# EAGLE design pidshield-mk-2 (EAGLE 6.5.0)
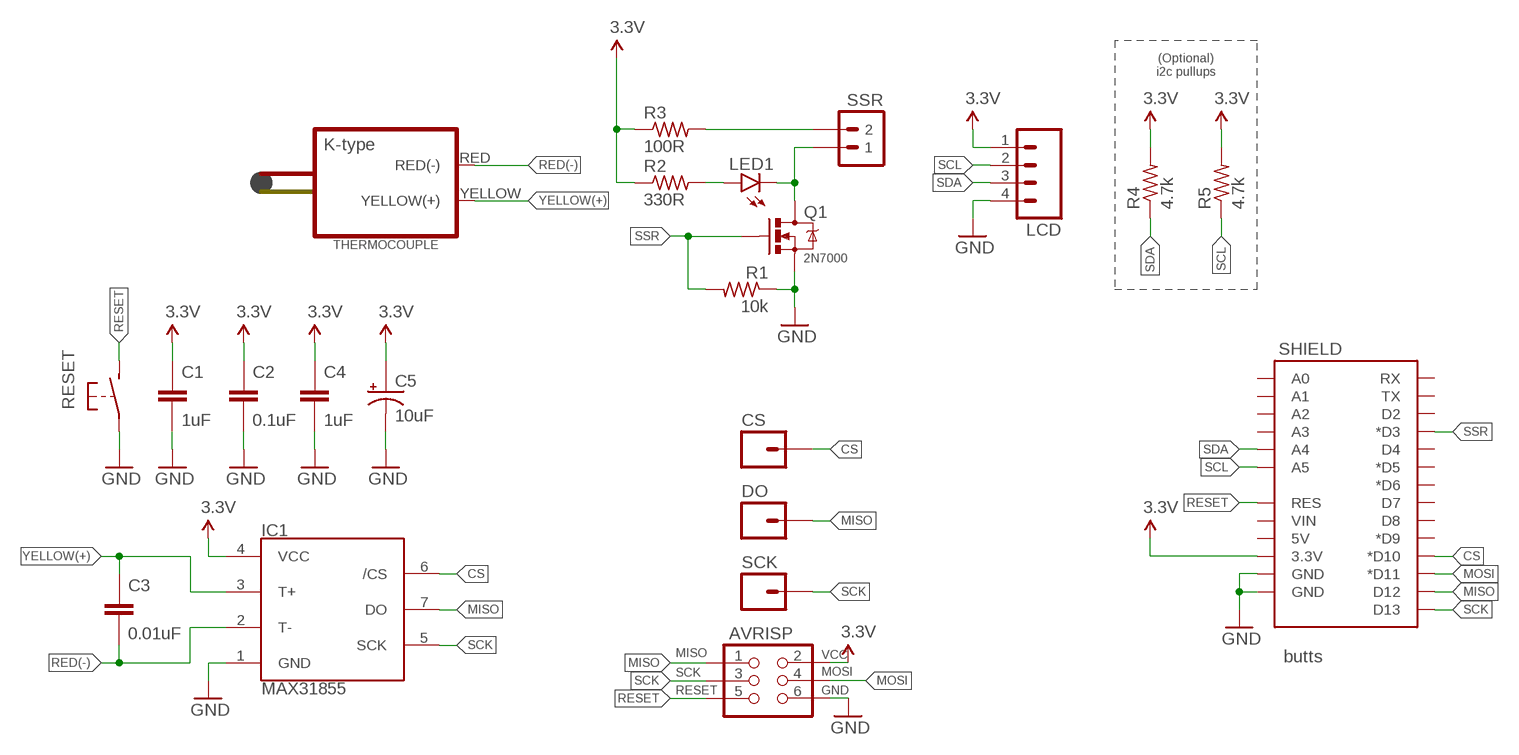
[diagram p0: schematic, sheet 1]

## Parts
AVRISP  AVR_SPI_PRG_6PTH  [2X3]
C1  1uF  CAPACITOR-CERAMIC025-024X044  [C025-024X044]
C2  0.1uF  CAPACITOR-CERAMIC025-024X044  [C025-024X044]
C3  0.01uF  CAPACITOR-CERAMIC025-024X044  [C025-024X044]
C4  1uF  CAPACITOR-CERAMIC025-024X044  [C025-024X044]
C5  10uF  CAPACITOR-POLARIZEDE2-5  [E2-5]
CS  M01PTH  [1X01]
DO  M01PTH  [1X01]
IC1  MAX31855  MAX31855SOIC  [SOIC127P600X175-8N]
LCD  M04JST_XH_RA  [JST-4-XH-RA-PTH]
LED1  LED3MM  [LED3MM]
Q1  2N7000  MOSFET-NCHANNEL2N7000-AMMO  [TO-92-AMMO]
R1  10k  RESISTORPTH-AXIAL-6.35MM  [RESISTOR-AXIAL-PTH-6.35MM]
R2  330R  RESISTORPTH-AXIAL-6.35MM  [RESISTOR-AXIAL-PTH-6.35MM]
R3  100R  RESISTORPTH-AXIAL-6.35MM  [RESISTOR-AXIAL-PTH-6.35MM]
R4  4.7k  RESISTORPTH-AXIAL-6.35MM  [RESISTOR-AXIAL-PTH-6.35MM]
R5  4.7k  RESISTORPTH-AXIAL-6.35MM  [RESISTOR-AXIAL-PTH-6.35MM]
RESET  SPST-NO-TACT6MM-PTH-SMALL-PADS  [DTS-6-SMALL-PADS]
SCK  M01PTH  [1X01]
SHIELD  butts  ARDUINO_SHIELD_SMALLER  [ARDUINO_SHIELD_NOOUTLINE_INSIDE_SMALLER]
SSR  M02JST-PTH-RA-SMALLPADS  [JST-2-PH-RA-PTH-SMALLPADS]
THERMOCOUPLE  THERMOCOUPLE-CONNECTORMINI-PCB  [PCC-SMP]

## Nets
3.3V: AVRISP.2(VCC) C1.1 C2.1 C4.1 C5.+ IC1.4(VCC) LCD.1 R2.P$1 R3.P$1 R4.P$2 R5.P$2 SHIELD.3.3V
CS: CS.1 IC1.6(/CS) SHIELD.D10(*D10)
GND: AVRISP.6(GND) C1.2 C2.2 C4.2 C5.- IC1.1(GND) LCD.4 Q1.1(S) R1.P$1 RESET.1 RESET.2 SHIELD.GND@0(GND) SHIELD.GND@1(GND)
MISO: AVRISP.1(MISO) DO.1 IC1.7(DO) SHIELD.D12
MOSI: AVRISP.4(MOSI) SHIELD.D11(*D11)
N$2: LED1.A R2.P$2
N$3: LED1.K(C) Q1.3(D) SSR.1
N$4: R3.P$2 SSR.2
RED(-): C3.2 IC1.2(T-) THERMOCOUPLE.RED(RED(-))
RESET: AVRISP.5(RESET) RESET.3 RESET.4 SHIELD.RES
SCK: AVRISP.3(SCK) IC1.5(SCK) SCK.1 SHIELD.D13
SCL: LCD.2 R5.P$1 SHIELD.A5
SDA: LCD.3 R4.P$1 SHIELD.A4
SSR: Q1.2(G) R1.P$2 SHIELD.D3(*D3)
YELLOW(+): C3.1 IC1.3(T+) THERMOCOUPLE.YELLOW(YELLOW(+))
Unconnected: SHIELD.5V SHIELD.A0 SHIELD.A1 SHIELD.A2 SHIELD.A3 SHIELD.D2 SHIELD.D4 SHIELD.D5(*D5) SHIELD.D6(*D6) SHIELD.D7 SHIELD.D8 SHIELD.D9(*D9) SHIELD.RX SHIELD.TX SHIELD.VIN

## Notes on the sheet
- (Optional)
  i2c pullups

## Library data of the parts
AVRISP = A_butts:AVR_SPI_PRG_6: AVR ISP 6 Pin This is the reduced ISP connector for AVR programming. Common on Arduino. This footprint will take up less PCB space and can be used with a 10-pin to 6-pin adapter such as SKU: BOB-08508 **Special note about "TEST_POINT" package. The stop mask is on the top side, so if you want your programming test points to be on the bottom of your board, make sure to place this package on the bottom side of the board. This also ensure that the orientation to program from the bottom side will be correct.
C1-C4 = A_butts:CAPACITOR-CERAMIC: CAPACITOR, European symbol
C5 = A_butts:CAPACITOR-POLARIZED: POLARIZED CAPACITOR, American symbol
CS DO SCK = A_butts:M01: Header 1 Standard 1-pin 0.1" header. Use with straight break away headers (SKU : PRT-00116), right angle break away headers (PRT-00553), swiss pins (PRT-00743), machine pins (PRT-00117), and female headers (PRT-00115).
IC1 = A_butts:MAX31855
LCD = A_butts:M04: Header 4 Standard 4-pin 0.1" header. Use with straight break away headers (SKU : PRT-00116), right angle break away headers (PRT-00553), swiss pins (PRT-00743), machine pins (PRT-00117), and female headers (PRT-00115). Molex polarized connector foot print use with SKU : PRT-08231 with associated crimp pins and housings. 1MM SMD Version SKU: PRT-10208
LED1 = A_butts:LED: LEDs Standard schematic elements and footprints for 5mm, 3mm, 1206, and 0603 sized LEDs. 5mm - Spark Fun Electronics SKU : COM-00529 (and others)
Q1 = A_butts:MOSFET-NCHANNEL: Common NMOSFET Parts MFG P/N Store ID Prod ID FDD8780 TRANS-09984 SI7820DN TRANS-11055 FDS6630A IC-08089 2N7002PW TRANS-11151 FQP30N06L COM-10213 TRANS-10060 BSS123LT1G TRANS-08345 BSS138 TRANS-00830 BS170 2N7000
R1-R5 = A_butts:RESISTOR: RESISTOR, American symbol
RESET = A_butts:SPST-NO-TACT
SHIELD = A_butts:ARDUINO_SHIELD_SMALLER
SSR = A_butts:M02: Standard 2-pin 0.1" header. Use with - straight break away headers ( PRT-00116) - right angle break away headers (PRT-00553) - swiss pins (PRT-00743) - machine pins (PRT-00117) - female headers (PRT-00115) Molex polarized connector foot print use with: PRT-08233 with associated crimp pins and housings. 2.54_SCREWTERM for use with PRT-10571. 3.5mm Screw Terminal footprints for PRT-08084 5mm Screw Terminal footprints for use with PRT-08433
THERMOCOUPLE = A_butts:THERMOCOUPLE-CONNECTOR

## Board
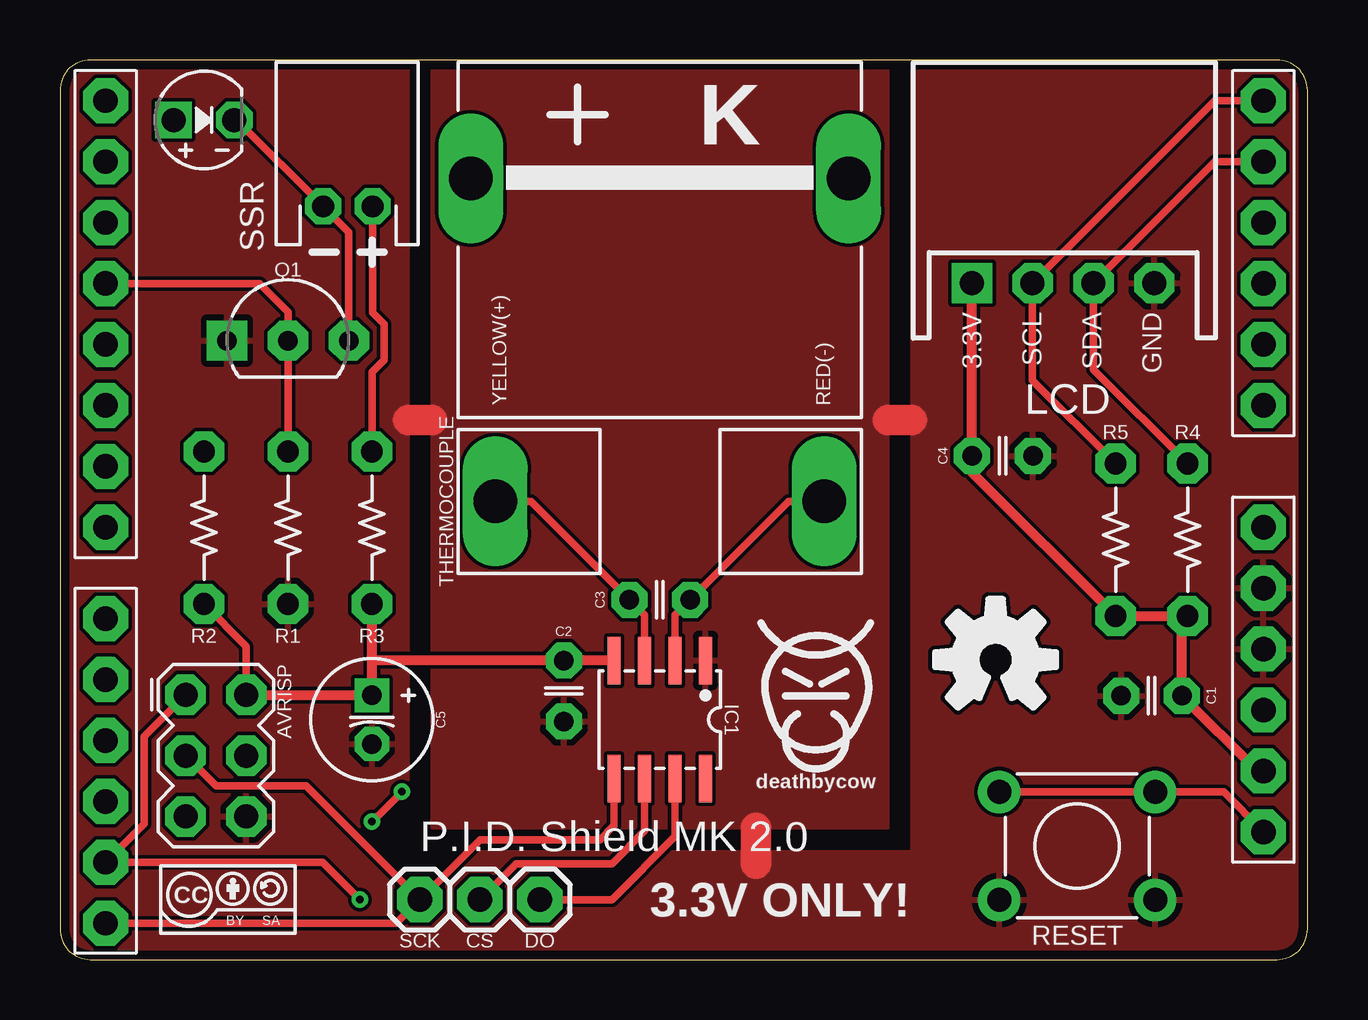
[diagram p1: board, top side]
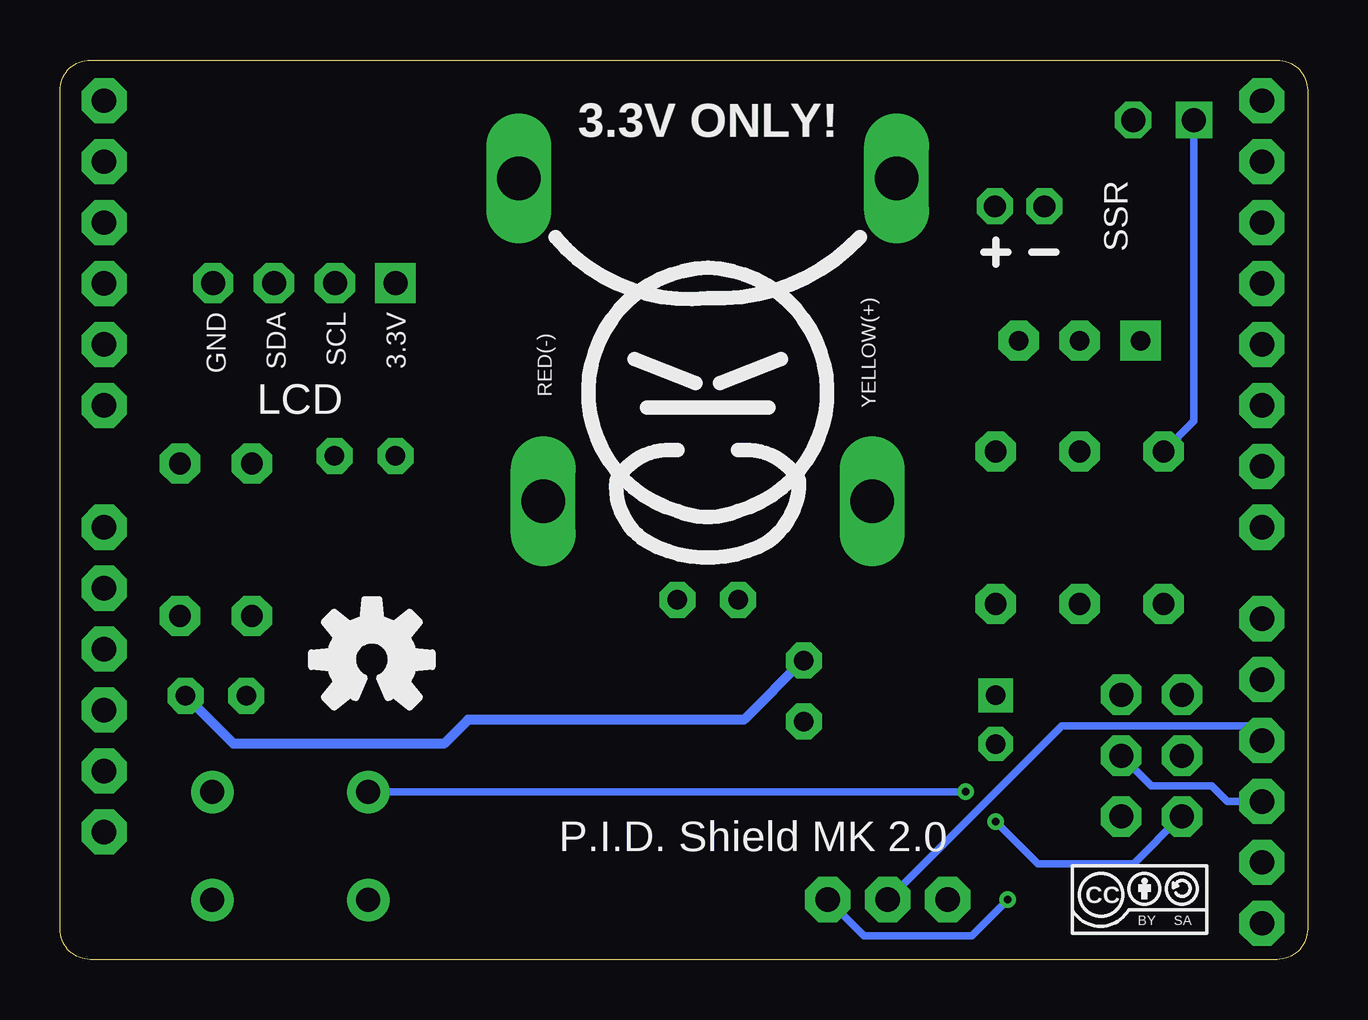
[diagram p2: board, bottom side, seen from below]

Size 52 x 37.5 mm. Coordinates in mm from the lower left corner, seen from the top.
Outline: 0,36.23 0,1.27 arc90 1.27,0 50.73,0 arc90 52,1.27 52,36.23 arc90 50.73,37.5 1.27,37.5 arc90 0,36.23
Copper layers (1*16): Top 0.0356mm / dielectric 1.5011mm / Bottom 0.0356mm
Design rules "LaenPCBOrder2": minimum track width 6mil, minimum drill 13mil, track to track 6mil, track to pad 6mil, pad to pad 6mil, via to via 6mil, smd to smd 6mil, copper to edge 15mil, drill to drill 6mil, minimum pad ring 7mil, minimum via ring 7mil, stop-mask expansion 3mil, vias tented up to drill 20mil, thermal gap 10mil

### Footprints (pad centres in the part's own frame; a part is rotated, then mirrored left to right if it is on the bottom)
2X3 = drill 1 pad 1.676 octagon: 1 -2.54,-1.27; 2 -2.54,1.27; 3 0,-1.27; 4 0,1.27; 5 2.54,-1.27; 6 2.54,1.27
C025-024X044 = drill 0.813 pad 1.5 octagon: 1 -1.27,0; 2 1.27,0
E2-5 = drill 0.813 pad 1.422 square: + -1.016,0 | drill 0.813 pad 1.422 octagon: - 1.016,0
1X01 = drill 1.016 pad 1.88 octagon: 1 0,0
SOIC127P600X175-8N = smd 1.981 x 0.559: 1 -2.464,1.905; 2 -2.464,0.635; 3 -2.464,-0.635; 4 -2.464,-1.905; 5 2.464,-1.905; 6 2.464,-0.635; 7 2.464,0.635; 8 2.464,1.905
JST-4-XH-RA-PTH = drill 1 pad 1.676 square: 1 0.02,0 | drill 1 pad 1.676 octagon: 2 2.54,0; 3 5.08,0; 4 7.62,0
LED3MM = drill 1 pad 1.524 square: A -1.27,0 | drill 1 pad 1.524 octagon: K 1.27,0
TO-92-AMMO = drill 0.813 pad 1.676 square: 1 -2.54,0 | drill 0.813 pad 1.676 octagon: 2 0,0; 3 2.54,0
RESISTOR-AXIAL-PTH-6.35MM = drill 0.9 pad 1.676 octagon: P$1 -3.175,0; P$2 3.175,0
DTS-6-SMALL-PADS = drill 1 pad 1.778: 1 -3.25,2.25; 2 3.25,2.25; 3 -3.25,-2.25; 4 3.25,-2.25
ARDUINO_SHIELD_NOOUTLINE_INSIDE_SMALLER = drill 1.016 pad 1.88 octagon: 3.3V 48.26,-27.94; 5V 48.26,-25.4; A0 48.26,-12.7; A1 48.26,-10.16; A2 48.26,-7.62; A3 48.26,-5.08; A4 48.26,-2.54; A5 48.26,0; D2 0,-5.08; D3 0,-7.62; D4 0,-10.16; D5 0,-12.7; D6 0,-15.24; D7 0,-17.78; D8 0,-21.59; D9 0,-24.13; D10 0,-26.67; D11 0,-29.21; D12 0,-31.75; D13 0,-34.29; GND@0 48.26,-22.86; GND@1 48.26,-20.32; RES 48.26,-30.48; RX 0,0; TX 0,-2.54; VIN 48.26,-17.78
JST-2-PH-RA-PTH-SMALLPADS = drill 0.9 pad 1.5 octagon: 1 -1.03,0; 2 1.03,0
PCC-SMP = drill 1.8 long: P$1 13.462,-7.874; P$2 13.462,7.874; RED 0,-6.858; YELLOW 0,6.858

### Placement (x,y rotation side)
AVRISP  6.5,8.5 270 top
C1  45.5,11 180 top
C2  21,11.19 270 top
C3  25,15 0 top
C4  39.29,21 0 top
C5  13,10 270 top
CS  17.5,2.5 180 top
DO  20,2.5 180 top
IC1  25,10 270 top
LCD  38,28.2 0 top
LED1  6,35 0 top
Q1  9.5,25.8 0 top
R1  9.5,18 90 top
R2  6,18 90 top
R3  13,18 90 top
R4  47,17.5 270 top
R5  44,17.5 270 top
RESET  42.4,4.73 180 top
SCK  15,2.5 180 top
SHIELD  1.9,35.8 0 top
SSR  12,31.4 0 top
THERMOCOUPLE  25,19.1 90 top
U$2  [COW]  25,22.5 0 bottom
U$3  [COW_SMALL]  31.5,11.5 0 top
U$4  [CC-BY-SA-4.0-NO-URL]  7,2.5 0 top
U$5  [CC-BY-SA-4.0-NO-URL]  7,2.5 0 bottom
U$6  [OSHWLOGO_TOP_0.2_A]  39,12.5 0 top
U$7  [OSHWLOGO_BOT_0.2_A]  39,12.5 0 top

### Tracks (layer width: path | path; a pad name or v marks a point on that pad's centre or on a via)
3.3V
  Top 0.305: R2.P$1 7.77,13.05 AVRISP.2
  Top 0.406: SHIELD.3.3V 49.91,7.86 C1.1 46.77,14.32 R4.P$2 R5.P$2 38.02,20.3 C4.1 LCD.1 | 13,12.5 C5.+ 12.98,11.04 AVRISP.2 | 13,12.5 R3.P$1 | 13,12.5 13.04,12.46 C2.1 IC1.4
  Bottom 0.406: C2.1 21.04,12.46 23.5,10 35,10 36,9 44.77,9 C1.1
CS
  Top 0.305: IC1.6 24.36,5.37 23,4 19,4 CS.1
  Bottom 0.305: CS.1 10.25,9.75 2.52,9.75 SHIELD.D10
GND
  Top 1.27: 34.5,22.5 35.5,22.5 | 14.5,22.5 15.5,22.5 | 29,4 29,5.5
  pour Top: 50.73,0 1.27,0 arc-90 0,1.27 0,36.23 arc-90 1.27,37.5 14.5,37.5 14.5,4.5 35.5,4.5 35.5,37.5 50.73,37.5 arc-90 52,36.23 52,1.27 arc-90
  pour Top: 15.5,37.5 34.5,37.5 34.5,5.5 15.5,5.5
MISO  (via drill 0.33)
  Top 0.305: DO.1 23,2.5 25.64,5.13 IC1.7 | v12.5,2.5 10.95,4.05 SHIELD.D12 3.5,5.65 3.5,9.31 AVRISP.1
  Bottom 0.305: v12.5,2.5 14,1 18.5,1 DO.1
MOSI
  Bottom 0.305: SHIELD.D11 3.34,6.59 4,7.25 6.52,7.25 AVRISP.4
N$2
  Bottom 0.305: R2.P$2 4.73,22.45 LED1.A
N$3
  Top 0.305: LED1.K 7.37,35 SSR.1 12.04,30.33 Q1.3
N$4
  Top 0.305: SSR.2 13.03,26.97 13.5,26.5 13.5,25 13,24.5 R3.P$2
RED(-)
  Top 0.305: THERMOCOUPLE.RED 30.37,19.1 C3.2 25.64,14.37 IC1.2
RESET  (via drill 0.33)
  Top 0.305: SHIELD.RES 48.5,6.98 RESET.3 RESET.4 | v13,5.75 v14.25,7
  Bottom 0.305: AVRISP.5 5.29,5.96 7.25,4 11.25,4 v13,5.75 | v14.25,7 39.13,7 RESET.4
SCK
  Top 0.305: IC1.5 23.09,5.59 22.5,5 17.5,5 SCK.1 | SHIELD.D13 14.01,1.51 SCK.1 | AVRISP.3 5.25,8.5 6.5,7.25 10.25,7.25 SCK.1
SCL
  Top 0.305: SHIELD.A5 48.14,35.8 LCD.2 40.54,24.14 R5.P$1
SDA
  Top 0.305: SHIELD.A4 48.14,33.26 LCD.3 43.08,24.59 R4.P$1
SSR
  Top 0.305: SHIELD.D3 8.32,28.18 9.5,27 Q1.2 R1.P$2
YELLOW(+)
  Top 0.305: THERMOCOUPLE.YELLOW 19.63,19.1 C3.1 24.36,14.37 IC1.3

### Text on the board
tPlace: 3.3V | SCL | SDA | GND | P.I.D. Shield MK 2.0 | 3.3V ONLY!
bPlace: 3.3V ONLY! | SSR | 3.3V | SCL | SDA | GND | LCD | P.I.D. Shield MK 2.0